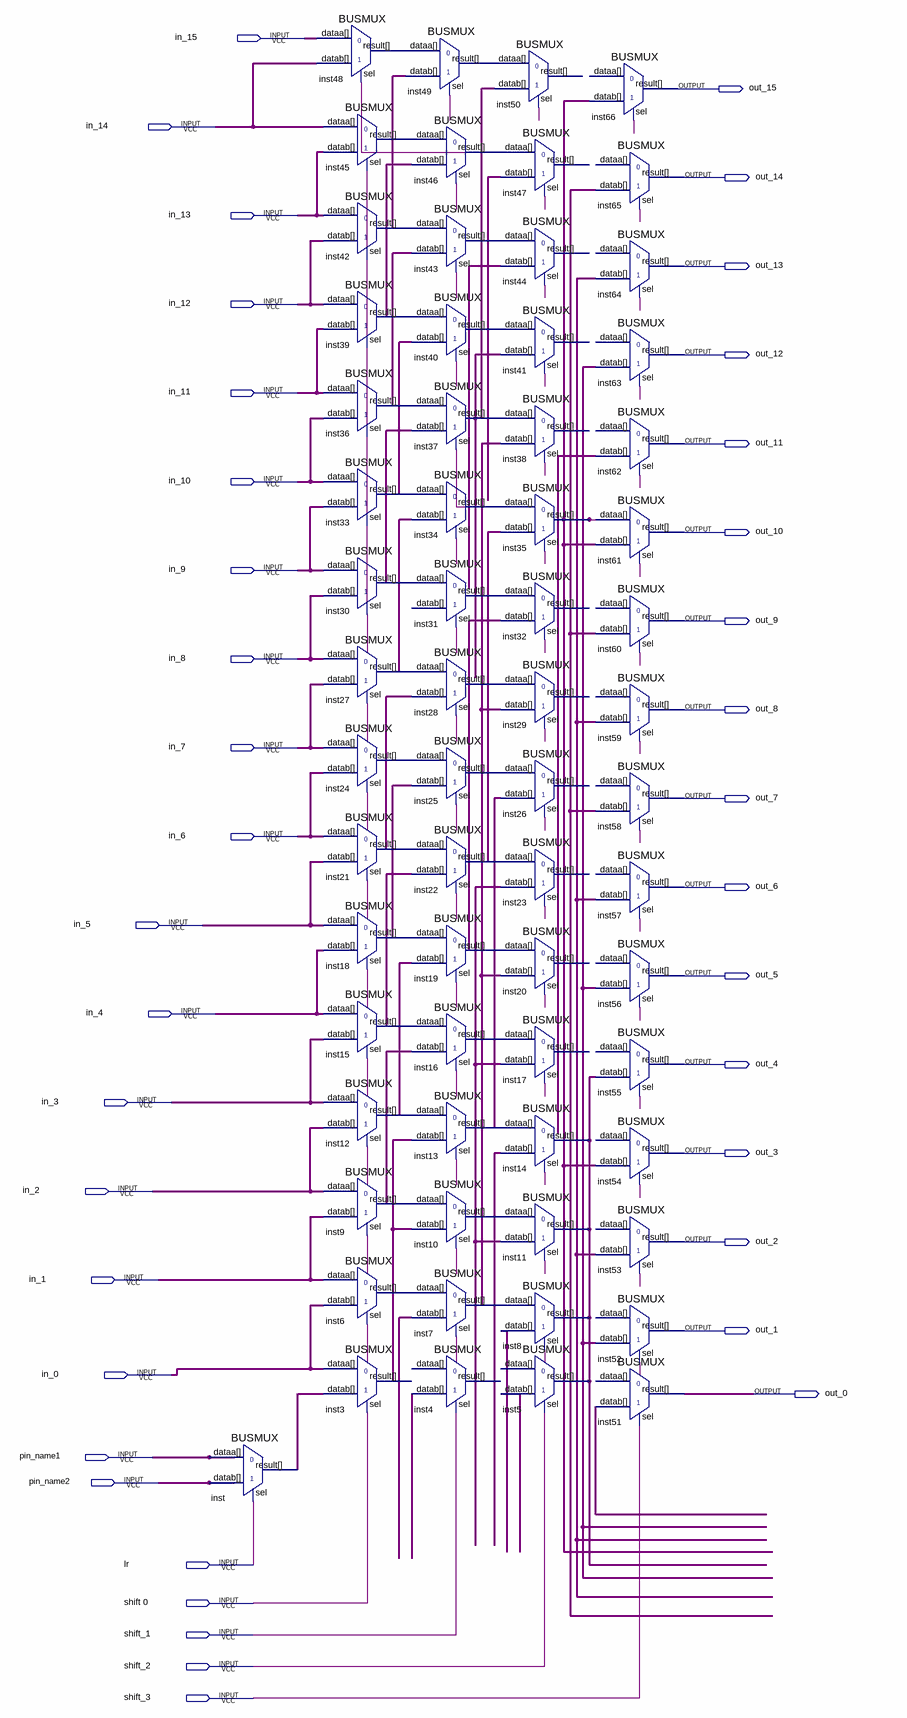
[diagram p0: schematic sheet]
// Quartus schematic Block1.bdf as structural Verilog: 65 symbols, 39 pins
module Block1 (
  input  in_15,
  input  in_14,
  input  in_13,
  input  in_12,
  input  in_11,
  input  in_10,
  input  in_9,
  input  in_8,
  input  in_7,
  input  in_6,
  input  in_5,
  input  in_4,
  input  in_3,
  input  in_2,
  input  in_1,
  input  in_0,
  input  pin_name1,
  input  pin_name2,
  input  lr,
  input  \shift_0 ,
  input  shift_1,
  input  shift_2,
  input  shift_3,
  output out_15,
  output out_14,
  output out_13,
  output out_12,
  output out_11,
  output out_10,
  output out_9,
  output out_8,
  output out_7,
  output out_6,
  output out_5,
  output out_4,
  output out_3,
  output out_2,
  output out_1,
  output out_0
);

  wire inst6_result, inst7_result, inst9_result, inst10_result, inst12_result, inst13_result, inst14_result,
       inst15_result, inst16_result, inst18_result, inst19_result, inst21_result, inst22_result,
       inst24_result, inst25_result, inst27_result, inst28_result, inst30_result, inst31_result,
       inst33_result, inst34_result, inst35_result, inst36_result, inst37_result, inst39_result,
       inst40_result, inst42_result, inst43_result, inst45_result, inst46_result, inst48_result,
       inst49_result, inst_result, undriven, undriven_2, undriven_3, undriven_4, undriven_5, undriven_6,
       undriven_7, undriven_8, undriven_9, undriven_10, undriven_11, undriven_12, undriven_13, undriven_14,
       undriven_15, undriven_16, undriven_17, undriven_18, undriven_19, undriven_20, undriven_21,
       undriven_22, undriven_23, undriven_24, undriven_25, undriven_26, undriven_27, undriven_28,
       undriven_29, undriven_30, undriven_31, undriven_32, undriven_33, undriven_34, undriven_35,
       undriven_36, undriven_37, undriven_38, undriven_39, undriven_40, undriven_41, undriven_42,
       undriven_43, undriven_44, undriven_45, undriven_46, undriven_47, undriven_48, undriven_49,
       undriven_50, undriven_51, undriven_52, undriven_53, undriven_54, undriven_55, undriven_56,
       undriven_57, undriven_58, undriven_59, undriven_60, undriven_61, undriven_62, undriven_63,
       undriven_64, undriven_65, undriven_66, undriven_67, undriven_68, undriven_69, undriven_70,
       undriven_71, undriven_72, undriven_73, undriven_74, undriven_75, undriven_76, undriven_77,
       undriven_78, undriven_79, undriven_80, undriven_81, undriven_82, undriven_83, undriven_84,
       undriven_85, undriven_86, undriven_87, undriven_88;

  BUSMUX inst (.datab(pin_name2), .sel(lr), .dataa(pin_name1), .result(inst_result));
  BUSMUX inst48 (.datab(in_14), .sel(inst46_result), .dataa(in_15), .result(inst48_result));
  BUSMUX inst45 (.datab(in_13), .sel(undriven_14), .dataa(in_14), .result(inst45_result));
  BUSMUX inst42 (.datab(in_12), .sel(undriven_13), .dataa(in_13), .result(inst42_result));
  BUSMUX inst39 (.datab(in_11), .sel(undriven_12), .dataa(in_12), .result(inst39_result));
  BUSMUX inst36 (.datab(in_10), .sel(undriven_11), .dataa(in_11), .result(inst36_result));
  BUSMUX inst33 (.datab(in_9), .sel(undriven_10), .dataa(in_10), .result(inst33_result));
  BUSMUX inst30 (.datab(in_8), .sel(undriven_9), .dataa(in_9), .result(inst30_result));
  BUSMUX inst27 (.datab(in_7), .sel(undriven_8), .dataa(in_8), .result(inst27_result));
  BUSMUX inst24 (.datab(in_6), .sel(undriven_7), .dataa(in_7), .result(inst24_result));
  BUSMUX inst21 (.datab(in_5), .sel(undriven_6), .dataa(in_6), .result(inst21_result));
  BUSMUX inst18 (.datab(in_4), .sel(undriven_5), .dataa(in_5), .result(inst18_result));
  BUSMUX inst15 (.datab(in_3), .sel(undriven_4), .dataa(in_4), .result(inst15_result));
  BUSMUX inst12 (.datab(in_2), .sel(undriven_3), .dataa(in_3), .result(inst12_result));
  BUSMUX inst9 (.datab(in_1), .sel(undriven_2), .dataa(in_2), .result(inst9_result));
  BUSMUX inst6 (.datab(in_0), .sel(undriven), .dataa(in_1), .result(inst6_result));
  BUSMUX inst3 (.datab(inst_result), .sel(\shift_0 ), .dataa(in_0));  // open: result
  BUSMUX inst49 (.datab(undriven_59), .sel(undriven_28), .dataa(inst48_result), .result(inst49_result));
  BUSMUX inst46 (.datab(undriven_60), .sel(undriven_27), .dataa(inst45_result), .result(inst46_result));
  BUSMUX inst43 (.datab(undriven_61), .sel(undriven_26), .dataa(inst42_result), .result(inst43_result));
  BUSMUX inst40 (.datab(undriven_63), .sel(undriven_25), .dataa(inst39_result), .result(inst40_result));
  BUSMUX inst37 (.datab(undriven_62), .sel(inst34_result), .dataa(inst36_result), .result(inst37_result));
  BUSMUX inst34 (.datab(undriven_64), .sel(undriven_24), .dataa(inst33_result), .result(inst34_result));
  BUSMUX inst31 (.sel(undriven_23), .dataa(inst30_result), .result(inst31_result));  // open: datab
  BUSMUX inst28 (.datab(undriven_65), .sel(undriven_22), .dataa(inst27_result), .result(inst28_result));
  BUSMUX inst25 (.datab(undriven_66), .sel(undriven_21), .dataa(inst24_result), .result(inst25_result));
  BUSMUX inst22 (.datab(undriven_67), .sel(undriven_20), .dataa(inst21_result), .result(inst22_result));
  BUSMUX inst19 (.datab(undriven_69), .sel(undriven_19), .dataa(inst18_result), .result(inst19_result));
  BUSMUX inst16 (.datab(undriven_68), .sel(undriven_18), .dataa(inst15_result), .result(inst16_result));
  BUSMUX inst13 (.datab(undriven_70), .sel(undriven_17), .dataa(inst12_result), .result(inst13_result));
  BUSMUX inst10 (.datab(undriven_70), .sel(undriven_16), .dataa(inst9_result), .result(inst10_result));
  BUSMUX inst7 (.datab(undriven_71), .sel(undriven_15), .dataa(inst6_result), .result(inst7_result));
  BUSMUX inst4 (.datab(undriven_72), .sel(shift_1));  // open: dataa, result
  BUSMUX inst50 (.datab(undriven_75), .sel(undriven_43), .dataa(inst49_result));  // open: result
  BUSMUX inst47 (.datab(undriven_73), .sel(undriven_42), .dataa(inst46_result));  // open: result
  BUSMUX inst44 (.datab(undriven_74), .sel(undriven_41), .dataa(inst43_result));  // open: result
  BUSMUX inst41 (.datab(undriven_75), .sel(undriven_40), .dataa(inst40_result));  // open: result
  BUSMUX inst38 (.datab(undriven_79), .sel(undriven_39), .dataa(inst37_result));  // open: result
  BUSMUX inst35 (.datab(undriven_76), .sel(undriven_38), .dataa(inst34_result), .result(inst35_result));
  BUSMUX inst32 (.datab(undriven_77), .sel(undriven_37), .dataa(inst31_result));  // open: result
  BUSMUX inst29 (.datab(undriven_79), .sel(undriven_36), .dataa(inst28_result));  // open: result
  BUSMUX inst26 (.datab(undriven_78), .sel(undriven_35), .dataa(inst25_result));  // open: result
  BUSMUX inst23 (.datab(undriven_81), .sel(undriven_34), .dataa(inst22_result));  // open: result
  BUSMUX inst20 (.datab(undriven_79), .sel(undriven_33), .dataa(inst19_result));  // open: result
  BUSMUX inst17 (.datab(undriven_81), .sel(undriven_32), .dataa(inst16_result));  // open: result
  BUSMUX inst14 (.datab(undriven_80), .sel(undriven_31), .dataa(inst13_result), .result(inst14_result));
  BUSMUX inst11 (.datab(undriven_81), .sel(undriven_30), .dataa(inst10_result), .result(inst14_result));
  BUSMUX inst8 (.datab(undriven_82), .sel(undriven_29), .dataa(inst7_result), .result(inst14_result));
  BUSMUX inst5 (.datab(undriven_83), .sel(shift_2), .result(inst14_result));  // open: dataa
  BUSMUX inst66 (.datab(inst35_result), .sel(undriven_58), .result(out_15));  // open: dataa
  BUSMUX inst65 (.datab(undriven_88), .sel(undriven_57), .result(out_14));  // open: dataa
  BUSMUX inst64 (.datab(undriven_87), .sel(undriven_56), .result(out_13));  // open: dataa
  BUSMUX inst63 (.datab(undriven_86), .sel(undriven_55), .result(out_12));  // open: dataa
  BUSMUX inst62 (.datab(undriven_84), .sel(undriven_54), .result(out_11));  // open: dataa
  BUSMUX inst61 (.datab(inst35_result), .sel(undriven_53), .dataa(inst35_result), .result(out_10));
  BUSMUX inst60 (.datab(undriven_88), .sel(undriven_52), .result(out_9));  // open: dataa
  BUSMUX inst59 (.datab(undriven_87), .sel(undriven_51), .result(out_8));  // open: dataa
  BUSMUX inst58 (.datab(undriven_88), .sel(undriven_50), .result(out_7));  // open: dataa
  BUSMUX inst57 (.datab(undriven_87), .sel(undriven_49), .result(out_6));  // open: dataa
  BUSMUX inst56 (.datab(undriven_86), .sel(undriven_48), .result(out_5));  // open: dataa
  BUSMUX inst55 (.datab(inst14_result), .sel(undriven_47), .result(out_4));  // open: dataa
  BUSMUX inst54 (.datab(inst35_result), .sel(undriven_46), .result(out_3));  // open: dataa
  BUSMUX inst53 (.datab(undriven_87), .sel(undriven_45), .result(out_2));  // open: dataa
  BUSMUX inst52 (.datab(undriven_86), .sel(undriven_44), .result(out_1));  // open: dataa
  BUSMUX inst51 (.datab(undriven_85), .sel(shift_3), .result(out_0));  // open: dataa
endmodule
